# Altium schematic sheet Sheet1.schdoc: Название платы
size 420 x 297 mm; ApprovedBy: Рогов; CheckedBy: Фамилия проверяющего; DrawnBy: Фамилия разработчика; DocumentNumber: Введите номер платы + Э3; SheetNumber: пусто если листов 1, иначе 1; SheetTotal: количество листов; Format: A3; DocumentType: тип схемы; Title1str: (вторая строка при необходимости); ImagePath: Введите номер платы
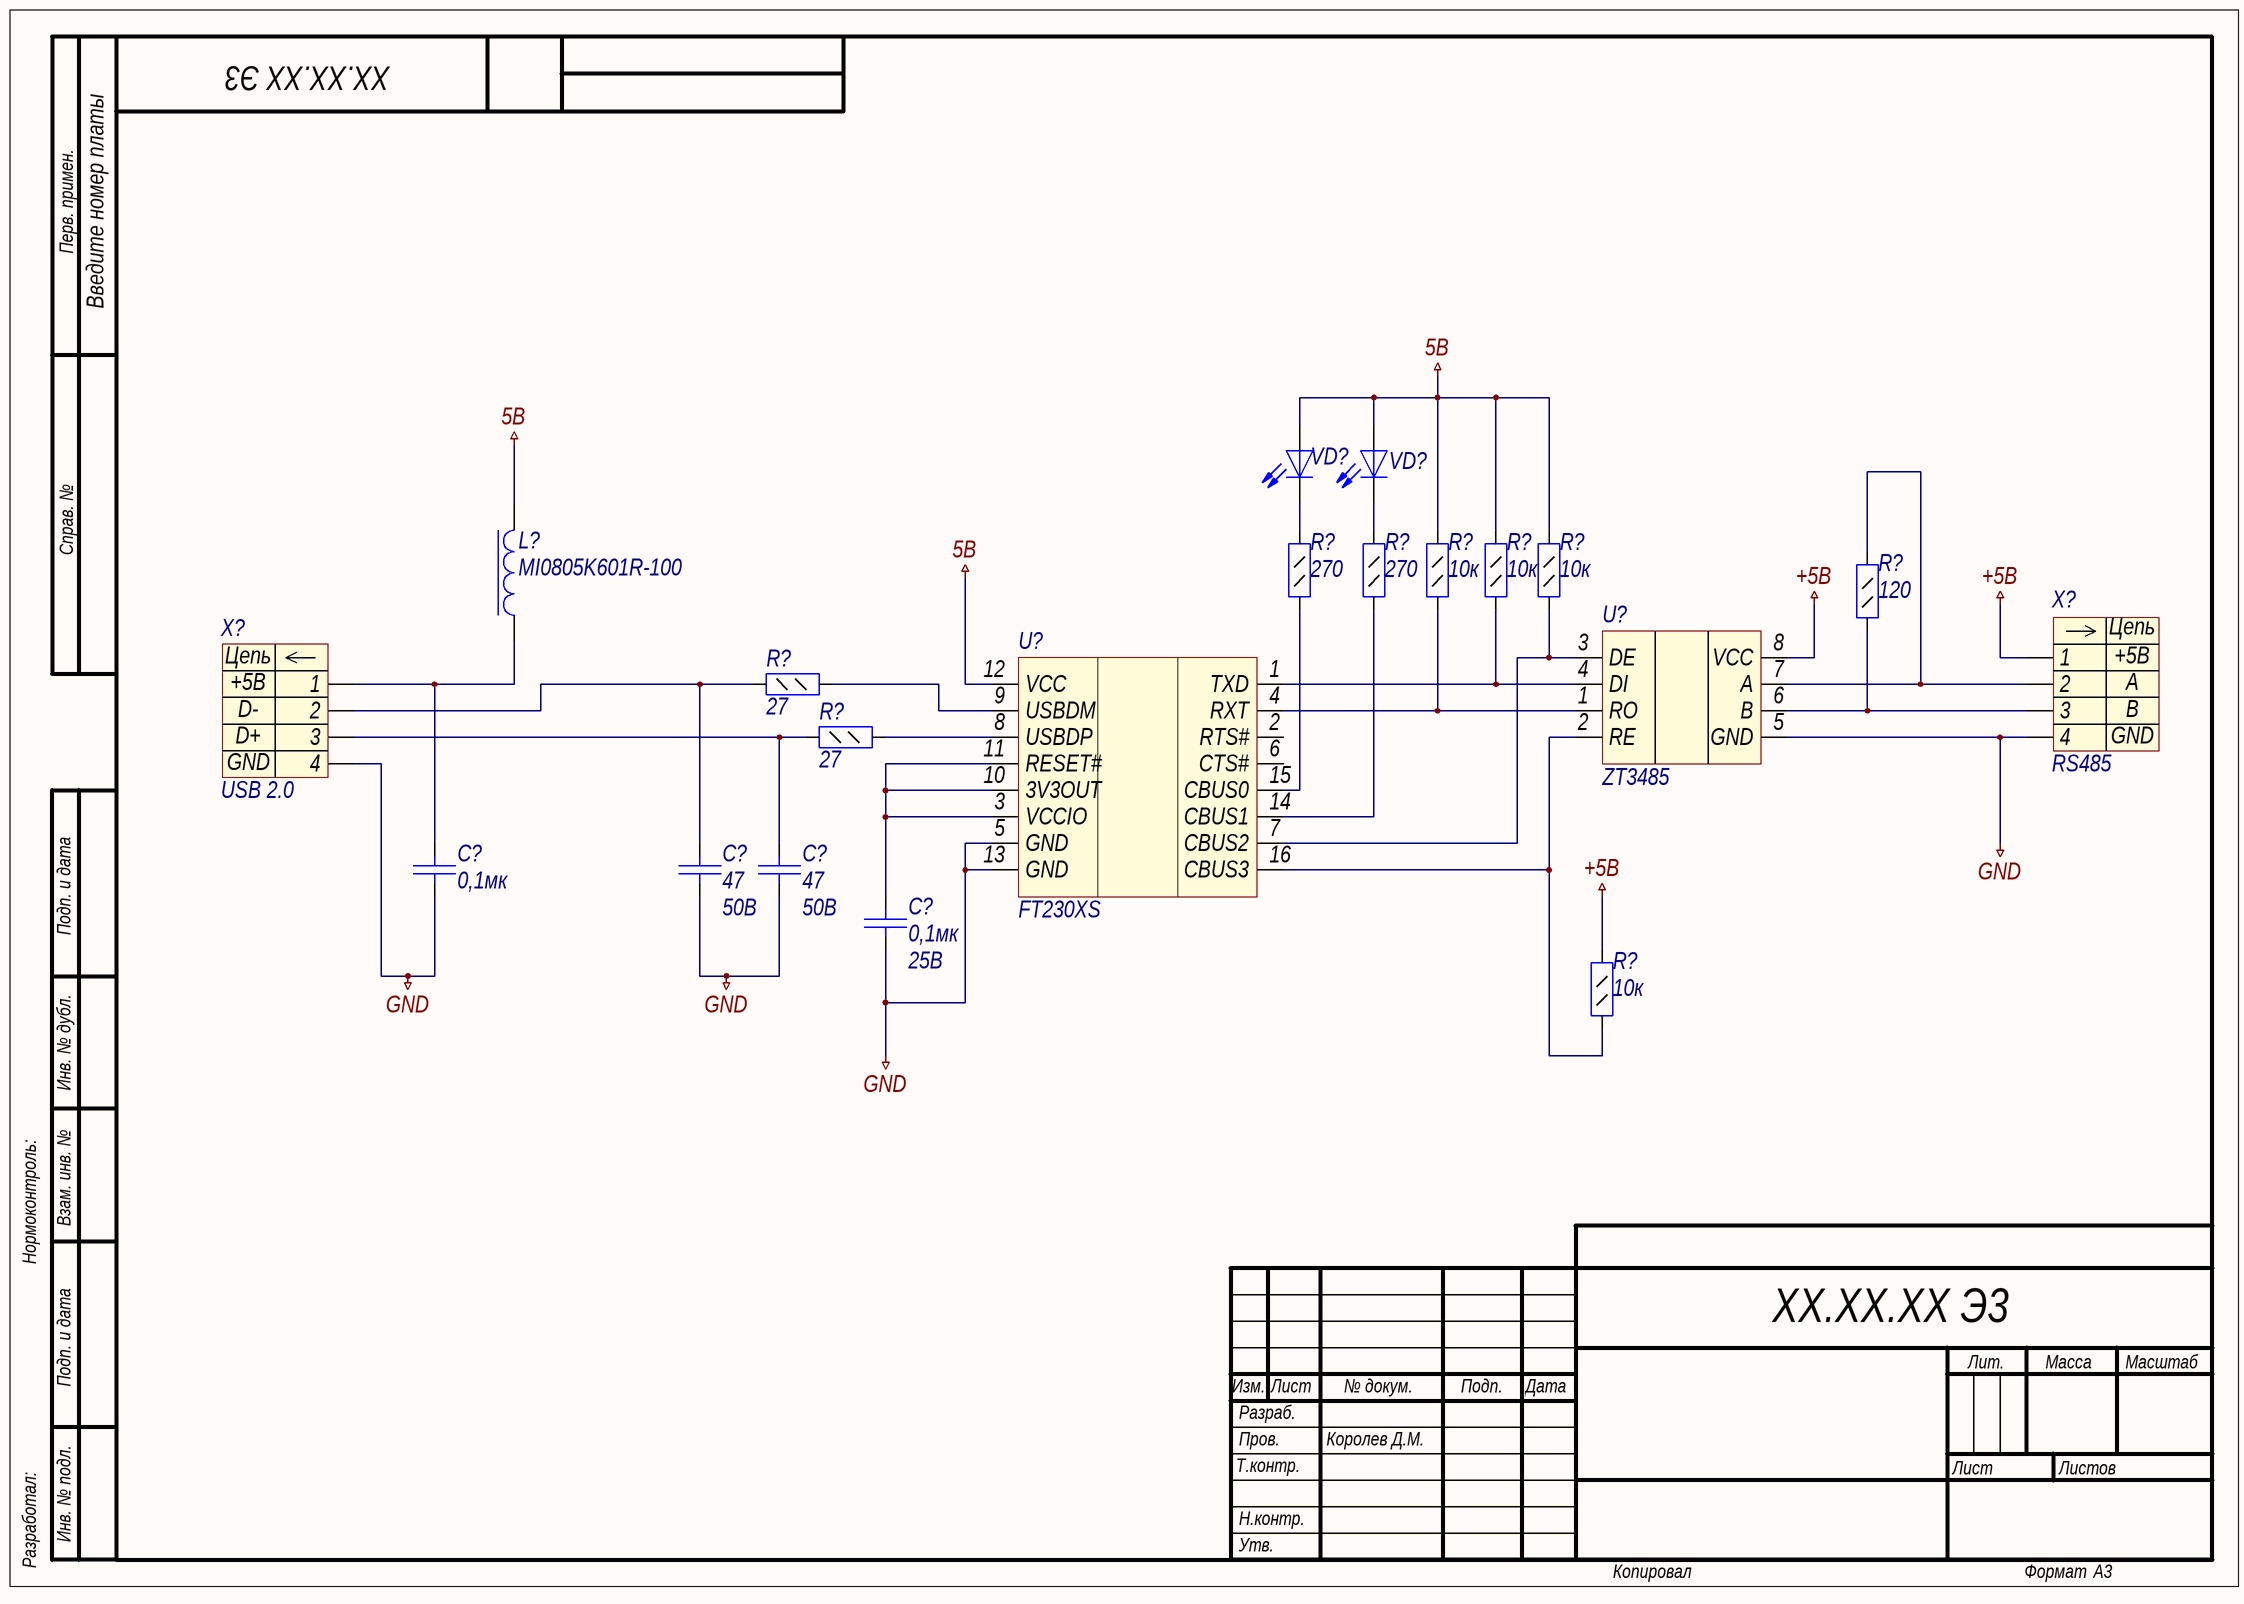
[diagram p0: Sheet1.schdoc]

## Parts
(Parts that share a designator on the sheet are numbered #1, #2 ... from top to bottom, then left to right.)
C?#1  value 0,1мк  [C0402]  (hidden comment: Capacitor)
C?#2  value 47  Voltage: 50B  [C0402]  (hidden comment: Capacitor)
C?#3  value 47  Voltage: 50B  [C0402]  (hidden comment: Capacitor)
C?#4  value 0,1мк  Voltage: 25B  [C0402]  (hidden comment: Capacitor)
L?  MI0805K601R-100
R?#1  value 270  [R0805]  (hidden comment: Resistor_0,125Вт)
R?#2  value 270  [R0805]  (hidden comment: Resistor_0,125Вт)
R?#3  value 10к  [R0805]  (hidden comment: Resistor_0,125Вт)
R?#4  value 10к  [R0805]  (hidden comment: Resistor_0,125Вт)
R?#5  value 10к  [R0805]  (hidden comment: Resistor_0,125Вт)
R?#6  value 120  [R0805]  (hidden comment: Resistor_0,125Вт)
R?#7  value 27  [R0805]  (hidden comment: Resistor_0,125Вт)
R?#8  value 27  [R0805]  (hidden comment: Resistor_0,125Вт)
R?#9  value 10к  [R0805]  (hidden comment: Resistor_0,125Вт)
U?#1  ZT3485
U?#2  FT230XS
VD?#1  LED  [L_0805]  (value not drawn)
VD?#2  LED  [L_0805]  (value not drawn)
X?#1  RS485
X?#2  USB 2.0

## Nets
5В: L?.3 R?#3.2 R?#4.2 R?#5.2 U?#2.12(VCC) VD?#1.2(A) VD?#2.2(A)
+5В: R?#9.2 U?#1.8(VCC) X?#1.1
GND: C?#1.1 C?#2.1 C?#3.1 C?#4.1 U?#1.5(GND) U?#2.5(GND) U?#2.13(GND) X?#1.4 X?#2.4
NetC?#1_2: C?#1.2 L?.2 X?#2.1
NetC?#2_2: C?#2.2 R?#7.1 X?#2.2
NetC?#3_2: C?#3.2 R?#8.1 X?#2.3
NetC?#4_2: C?#4.2 U?#2.3(VCCIO) U?#2.10(3V3OUT) U?#2.11(RESET#)
NetR?#1_1: R?#1.1 U?#2.15(CBUS0)
NetR?#1_2: R?#1.2 VD?#1.1(K)
NetR?#2_1: R?#2.1 U?#2.14(CBUS1)
NetR?#2_2: R?#2.2 VD?#2.1(K)
NetR?#3_1: R?#3.1 U?#1.1(RO) U?#2.4(RXT)
NetR?#4_1: R?#4.1 U?#1.4(DI) U?#2.1(TXD)
NetR?#5_1: R?#5.1 U?#1.3(DE) U?#2.7(CBUS2)
NetR?#6_1: R?#6.1 U?#1.6(B) X?#1.3
NetR?#6_2: R?#6.2 U?#1.7(A) X?#1.2
NetR?#7_2: R?#7.2 U?#2.9(USBDM)
NetR?#8_2: R?#8.2 U?#2.8(USBDP)
NetR?#9_1: R?#9.1 U?#1.2(RE) U?#2.16(CBUS3)

Not connected (* = marked no-connect by the designer): U?#2 2(RTS#) 6(CTS#)

## Notes on the sheet
- ХХ.ХХ.ХХ Э3
- Перв. примен.
- Справ. №
- Подп. и дата
- Инв. № дубл.
- Нормоконтроль:
- Взам. инв. №
- XX.XX.XX Э3
- Изм.
- Лист
- № докум.
- Подп.
- Дата
- Лит.
- Масса
- Масштаб
- Т.контр.
- Пров.
- Разраб.
- Королев Д.М.
- Листов
- Разработал:
- Инв. № подл.
- Н.контр.
- Утв.
- Копировал
- Формат
- (in symbol RS485) Цепь; +5В; A; B; GND
- (in symbol USB 2.0) Цепь; +5В; D-; D+; GND

## Library data of the parts
C?#1 C?#4 = cap52: Конденсатор; Part Name: Capacitors; Part Number: GRM155F51E104Z**; id: cap52; TKE: Y5V
C?#2 C?#3 = cap14: Конденсатор; Part Name: Capacitors; Part Number: GRM1555C1H470J; id: cap14; TKE: NP0
R?#1 R?#2 = res59: Резистор; id: res59; Accuracy: 1%; Part Name: Resistor; Power: 0,125Вт
R?#3-R?#5 R?#9 = res97: Резистор; id: res97; Accuracy: 1%; Part Name: Resistor; Power: 0,125Вт
R?#6 = res51: Резистор; id: res51; Accuracy: 1%; Part Name: Resistor; Power: 0,125Вт
R?#7 R?#8 = res35: Резистор; id: res35; Accuracy: 1%; Part Name: Resistor; Power: 0,125Вт
VD?#1 VD?#2 = diode8: Светодиод; Part Number: KP-2012EC; id: diode8; Part Name: LED